# Altium schematic sheet RS232.SchDoc
size A2; DocumentNumber: 4; SheetNumber: 4; SheetTotal: 9
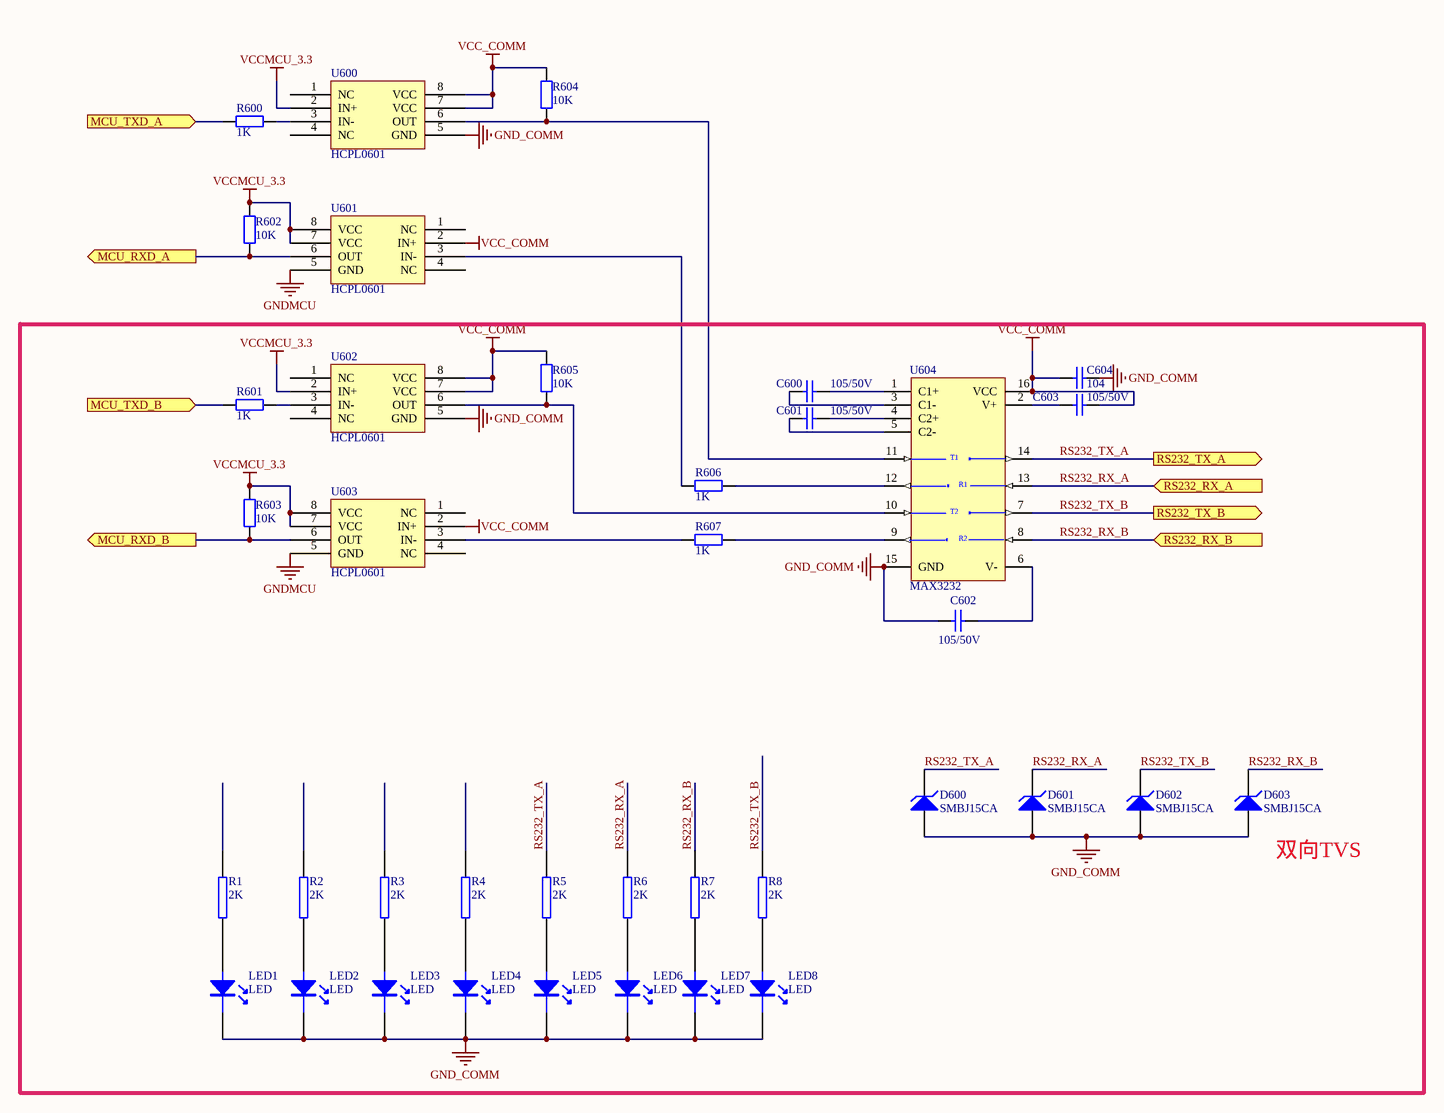
[diagram p0: RS232.SchDoc]

## Parts
C600  105/50V  [0805/C2]
C601  105/50V  [0805/C2]
C602  105/50V  [0805/C2]
C603  105/50V  [0805/C2]
C604  104  [0805/C2]
D600  SMBJ15CA  [SMB]
D601  SMBJ15CA  [SMB]
D602  SMBJ15CA  [SMB]
D603  SMBJ15CA  [SMB]
LED1  LED  [LED0805]
LED2  LED  [LED0805]
LED3  LED  [LED0805]
LED4  LED  [LED0805]
LED5  LED  [LED0805]
LED6  LED  [LED0805]
LED7  LED  [LED0805]
LED8  LED  [LED0805]
R1  2K  [0805/R2]
R2  2K  [0805/R2]
R3  2K  [0805/R2]
R4  2K  [0805/R2]
R5  2K  [0805/R2]
R6  2K  [0805/R2]
R7  2K  [0805/R2]
R8  2K  [0805/R2]
R600  1K  [0805/R2]
R601  1K  [0805/R2]
R602  10K  [0805/R2]
R603  10K  [0805/R2]
R604  10K  [0805/R2]
R605  10K  [0805/R2]
R606  1K  [0805/R2]
R607  1K  [RESC_E0805_2012X50N]
U600  HCPL0601  [HCPL0601]
U601  HCPL0601  [HCPL0601]
U602  HCPL0601  [HCPL0601]
U603  HCPL0601  [HCPL0601]
U604  MAX3232  [SO-16]

## Blocks framed on the sheet
双向TVS: C600-C604 D600-D603 LED1-LED8 R1-R8 R601 R603 R605-R607 U602-U604

## Ports
MCU_RXD_A (out), MCU_RXD_B (out), MCU_TXD_A (in), MCU_TXD_B (in), RS232_RX_A (in), RS232_RX_B (in), RS232_TX_A (out), RS232_TX_B (out)

## Nets
GND_COMM: C602.1 C604.1 D600.1(A) D601.1(A) D602.1(A) D603.1(A) LED1.2 LED2.2 LED3.2 LED4.2 LED5.2 LED6.2 LED7.2 LED8.2 U600.5(GND) U602.5(GND) U604.15(GND)
GNDMCU: U601.5(GND) U603.5(GND)
VCC_COMM: C603.2 C604.2 R604.2 R605.2 U600.7(VCC) U600.8(VCC) U601.2(IN+) U602.7(VCC) U602.8(VCC) U603.2(IN+) U604.16(VCC)
VCCMCU_3.3: R602.2 R603.2 U600.2(IN+) U601.7(VCC) U601.8(VCC) U602.2(IN+) U603.7(VCC) U603.8(VCC)
MCU_RXD_A: R602.1 U601.6(OUT) ; port MCU_RXD_A
MCU_RXD_B: R603.1 U603.6(OUT) ; port MCU_RXD_B
MCU_TXD_A: R600.1 ; port MCU_TXD_A
MCU_TXD_B: R601.1 ; port MCU_TXD_B
RS232_RX_A: D601.2(K) R6.2 U604.13(R1IN) ; port RS232_RX_A
RS232_RX_B: D603.2(K) R7.2 U604.8(R2IN) ; port RS232_RX_B
RS232_TX_A: D600.2(K) R5.2 U604.14(T1OUT) ; port RS232_TX_A
RS232_TX_B: D602.2(K) R8.2 U604.7(T2OUT) ; port RS232_TX_B
NetC600_1: C600.1 U604.1(C1+)
NetC600_2: C600.2 U604.3(C1-)
NetC601_1: C601.1 U604.4(C2+)
NetC601_2: C601.2 U604.5(C2-)
NetC602_2: C602.2 U604.6(V-)
NetC603_1: C603.1 U604.2(V+)
NetLED1_1: LED1.1 R1.1
NetLED2_1: LED2.1 R2.1
NetLED3_1: LED3.1 R3.1
NetLED4_1: LED4.1 R4.1
NetLED5_1: LED5.1 R5.1
NetLED6_1: LED6.1 R6.1
NetLED7_1: LED7.1 R7.1
NetLED8_1: LED8.1 R8.1
NetR600_2: R600.2 U600.3(IN-)
NetR601_2: R601.2 U602.3(IN-)
NetR604_1: R604.1 U600.6(OUT) U604.11(T1IN)
NetR605_1: R605.1 U602.6(OUT) U604.10(T2IN)
NetR606_1: R606.1 U601.3(IN-)
NetR606_2: R606.2 U604.12(R1OUT)
NetR607_1: R607.1 U603.3(IN-)
NetR607_2: R607.2 U604.9(R2OUT)

Not connected (* = marked no-connect by the designer): R1 2; R2 2; R3 2; R4 2; U600 1(NC) 4(NC); U601 1(NC) 4(NC); U602 1(NC) 4(NC); U603 1(NC) 4(NC)

## Notes on the sheet
- (in symbol MAX3232) T1; R1; T2; R2

## Library data of the parts
C600-C604 = CAP: Capacitor; Published: 8-Jun-2000; LatestRevisionDate: 17-Jul-2002; LatestRevisionNote: Re-released for DXP Platform.; PackageReference: RAD-0.3; Publisher: Altium Limited
D600-D603 = D Zener: Zener Diode; Published: 8-Jun-2000; LatestRevisionDate: 17-Jul-2002; LatestRevisionNote: Re-released for DXP Platform.; PackageReference: DIODE-0.7; Publisher: Altium Limited
LED1-LED8 = LED-PH
R1-R8 = RES2
R600-R607 = RES1
U600-U603 = 6N137